# Altium schematic sheet silniki.SchDoc
size A4; SheetNumber: 4; SheetTotal: 6
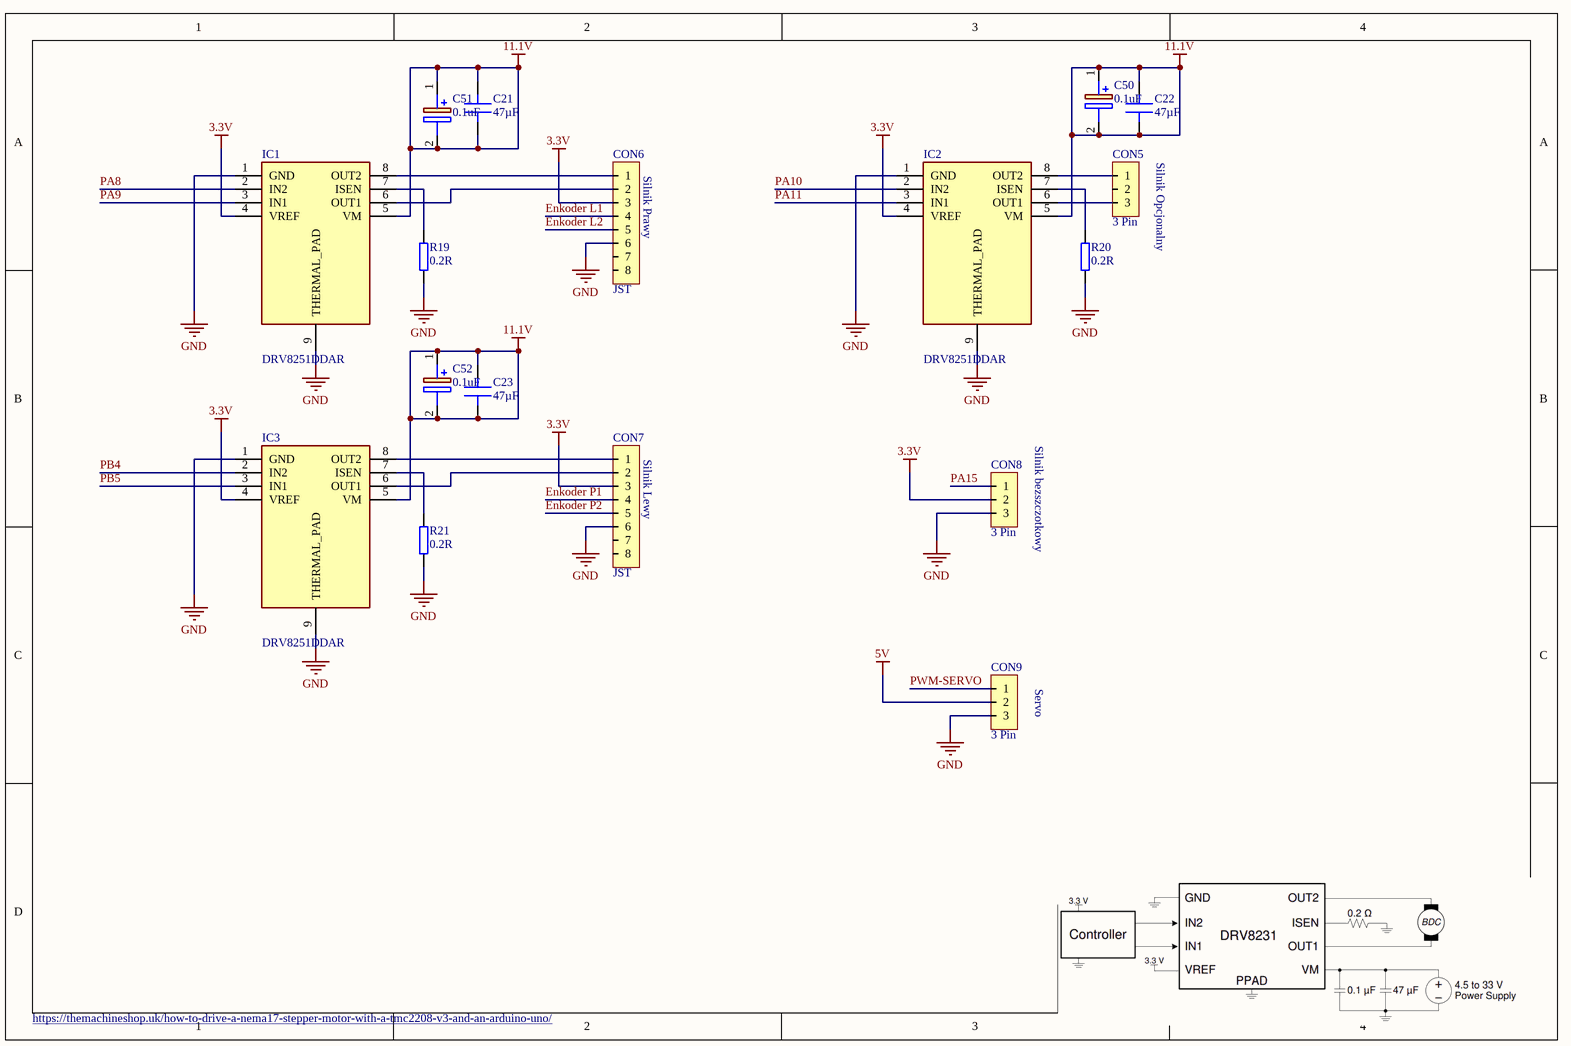
[diagram p0: silniki.SchDoc]

## Parts
C21  47µF  [C 0603]
C22  47µF  [C 0603]
C23  47µF  [C 0603]
C50  0.1uF  [CAPPRD250W50D655H1250]
C51  0.1uF  [CAPPRD250W50D655H1250]
C52  0.1uF  [CAPPRD250W50D655H1250]
CON5  3 Pin  [BM03B-SRSS-TB]
CON6  JST  [BM08B-SRSS-TB]
CON7  JST  [BM08B-SRSS-TB]
CON8  3 Pin  [BM03B-SRSS-TB]
CON9  3 Pin  [BM03B-SRSS-TB]
IC1  DRV8251DDAR  [SOIC127P600X170-9N]
IC2  DRV8251DDAR  [SOIC127P600X170-9N]
IC3  DRV8251DDAR  [SOIC127P600X170-9N]
R19  0.2R  [R 1206]
R20  0.2R  [R 1206]
R21  0.2R  [R 1206]

## Nets
3.3V: CON6.3 CON7.3 CON8.2 IC1.4(VREF) IC2.4(VREF) IC3.4(VREF)
5V: CON9.2
11.1V: C21.1 C21.2 C22.1 C22.2 C23.1 C23.2 C50.1(+) C50.2(-) C51.1(+) C51.2(-) C52.1(+) C52.2(-) IC1.5(VM) IC2.5(VM) IC3.5(VM)
GND: CON6.6 CON7.6 CON8.3 CON9.3 IC1.1(GND) IC1.9(THERMAL_PAD) IC2.1(GND) IC2.9(THERMAL_PAD) IC3.1(GND) IC3.9(THERMAL_PAD) R19.1 R20.1 R21.1
Enkoder L1: CON6.4
Enkoder L2: CON6.5
Enkoder P1: CON7.4
Enkoder P2: CON7.5
PA8: IC1.2(IN2)
PA9: IC1.3(IN1)
PA10: IC2.2(IN2)
PA11: IC2.3(IN1)
PA15: CON8.1
PB4: IC3.2(IN2)
PB5: IC3.3(IN1)
PWM-SERVO: CON9.1
NetCON5_1: CON5.1 IC2.8(OUT2)
NetCON5_3: CON5.3 IC2.6(OUT1)
NetCON6_1: CON6.1 IC1.8(OUT2)
NetCON6_2: CON6.2 IC1.6(OUT1)
NetCON7_1: CON7.1 IC3.8(OUT2)
NetCON7_2: CON7.2 IC3.6(OUT1)
NetIC1_7: IC1.7(ISEN) R19.2
NetIC2_7: IC2.7(ISEN) R20.2
NetIC3_7: IC3.7(ISEN) R21.2

Not connected (* = marked no-connect by the designer): CON5 2; CON6 7 8; CON7 7 8

## Notes on the sheet
- (near CON6) Silnik Prawy
- Silnik Opcjonalny
- (near CON7) Silnik Lewy
- (near CON8) Silnik bezszczotkowy
- (near CON9) Servo
- https://themachineshop.uk/how-to-drive-a-nema17-stepper-motor-with-a-tmc2208-v3-and-an-arduino-uno/

## Library data of the parts
C21-C23 = Capacitor: MLCC Capacitor
C50-C52 = UVZ1H331MPD: Capacitor Polarised; Manufacturer_Name: Nichicon; Datasheet Link: https://www.nichicon.co.jp/english/products/pdfs/e-uvz.pdf; Height: 17.5mm; Manufacturer_Part_Number: UVZ1H331MPD; Mouser Part Number: 647-UVZ1H331MPD; Mouser Price/Stock: https://www.mouser.co.uk/ProductDetail/Nichicon/UVZ1H331MPD?qs=c%252BikF0N8D5kXe1Z5OktPOg%3D%3D
CON6 CON7 = 8 Pin
IC1-IC3 = DRV8251DDAR: Integrated Circuit; Manufacturer_Name: Texas Instruments; Datasheet Link: https://www.arrow.com/en/products/drv8251ddar/texas-instruments?region=nac; Height: 1.7mm; Manufacturer_Part_Number: DRV8251DDAR; Mouser Part Number: 595-DRV8251DDAR; Mouser Price/Stock: https://www.mouser.co.uk/ProductDetail/Texas-Instruments/DRV8251DDAR?qs=doiCPypUmgHTzZyfapGahQ%3D%3D; Arrow Part Number: DRV8251DDAR; Arrow Price/Stock: https://www.arrow.com/en/products/drv8251ddar/texas-instruments?region=nac
R19-R21 = Resistor: General pourpouse resistor